# Altium schematic sheet RP2040_minimal.SchDoc
size 419 x 297 mm
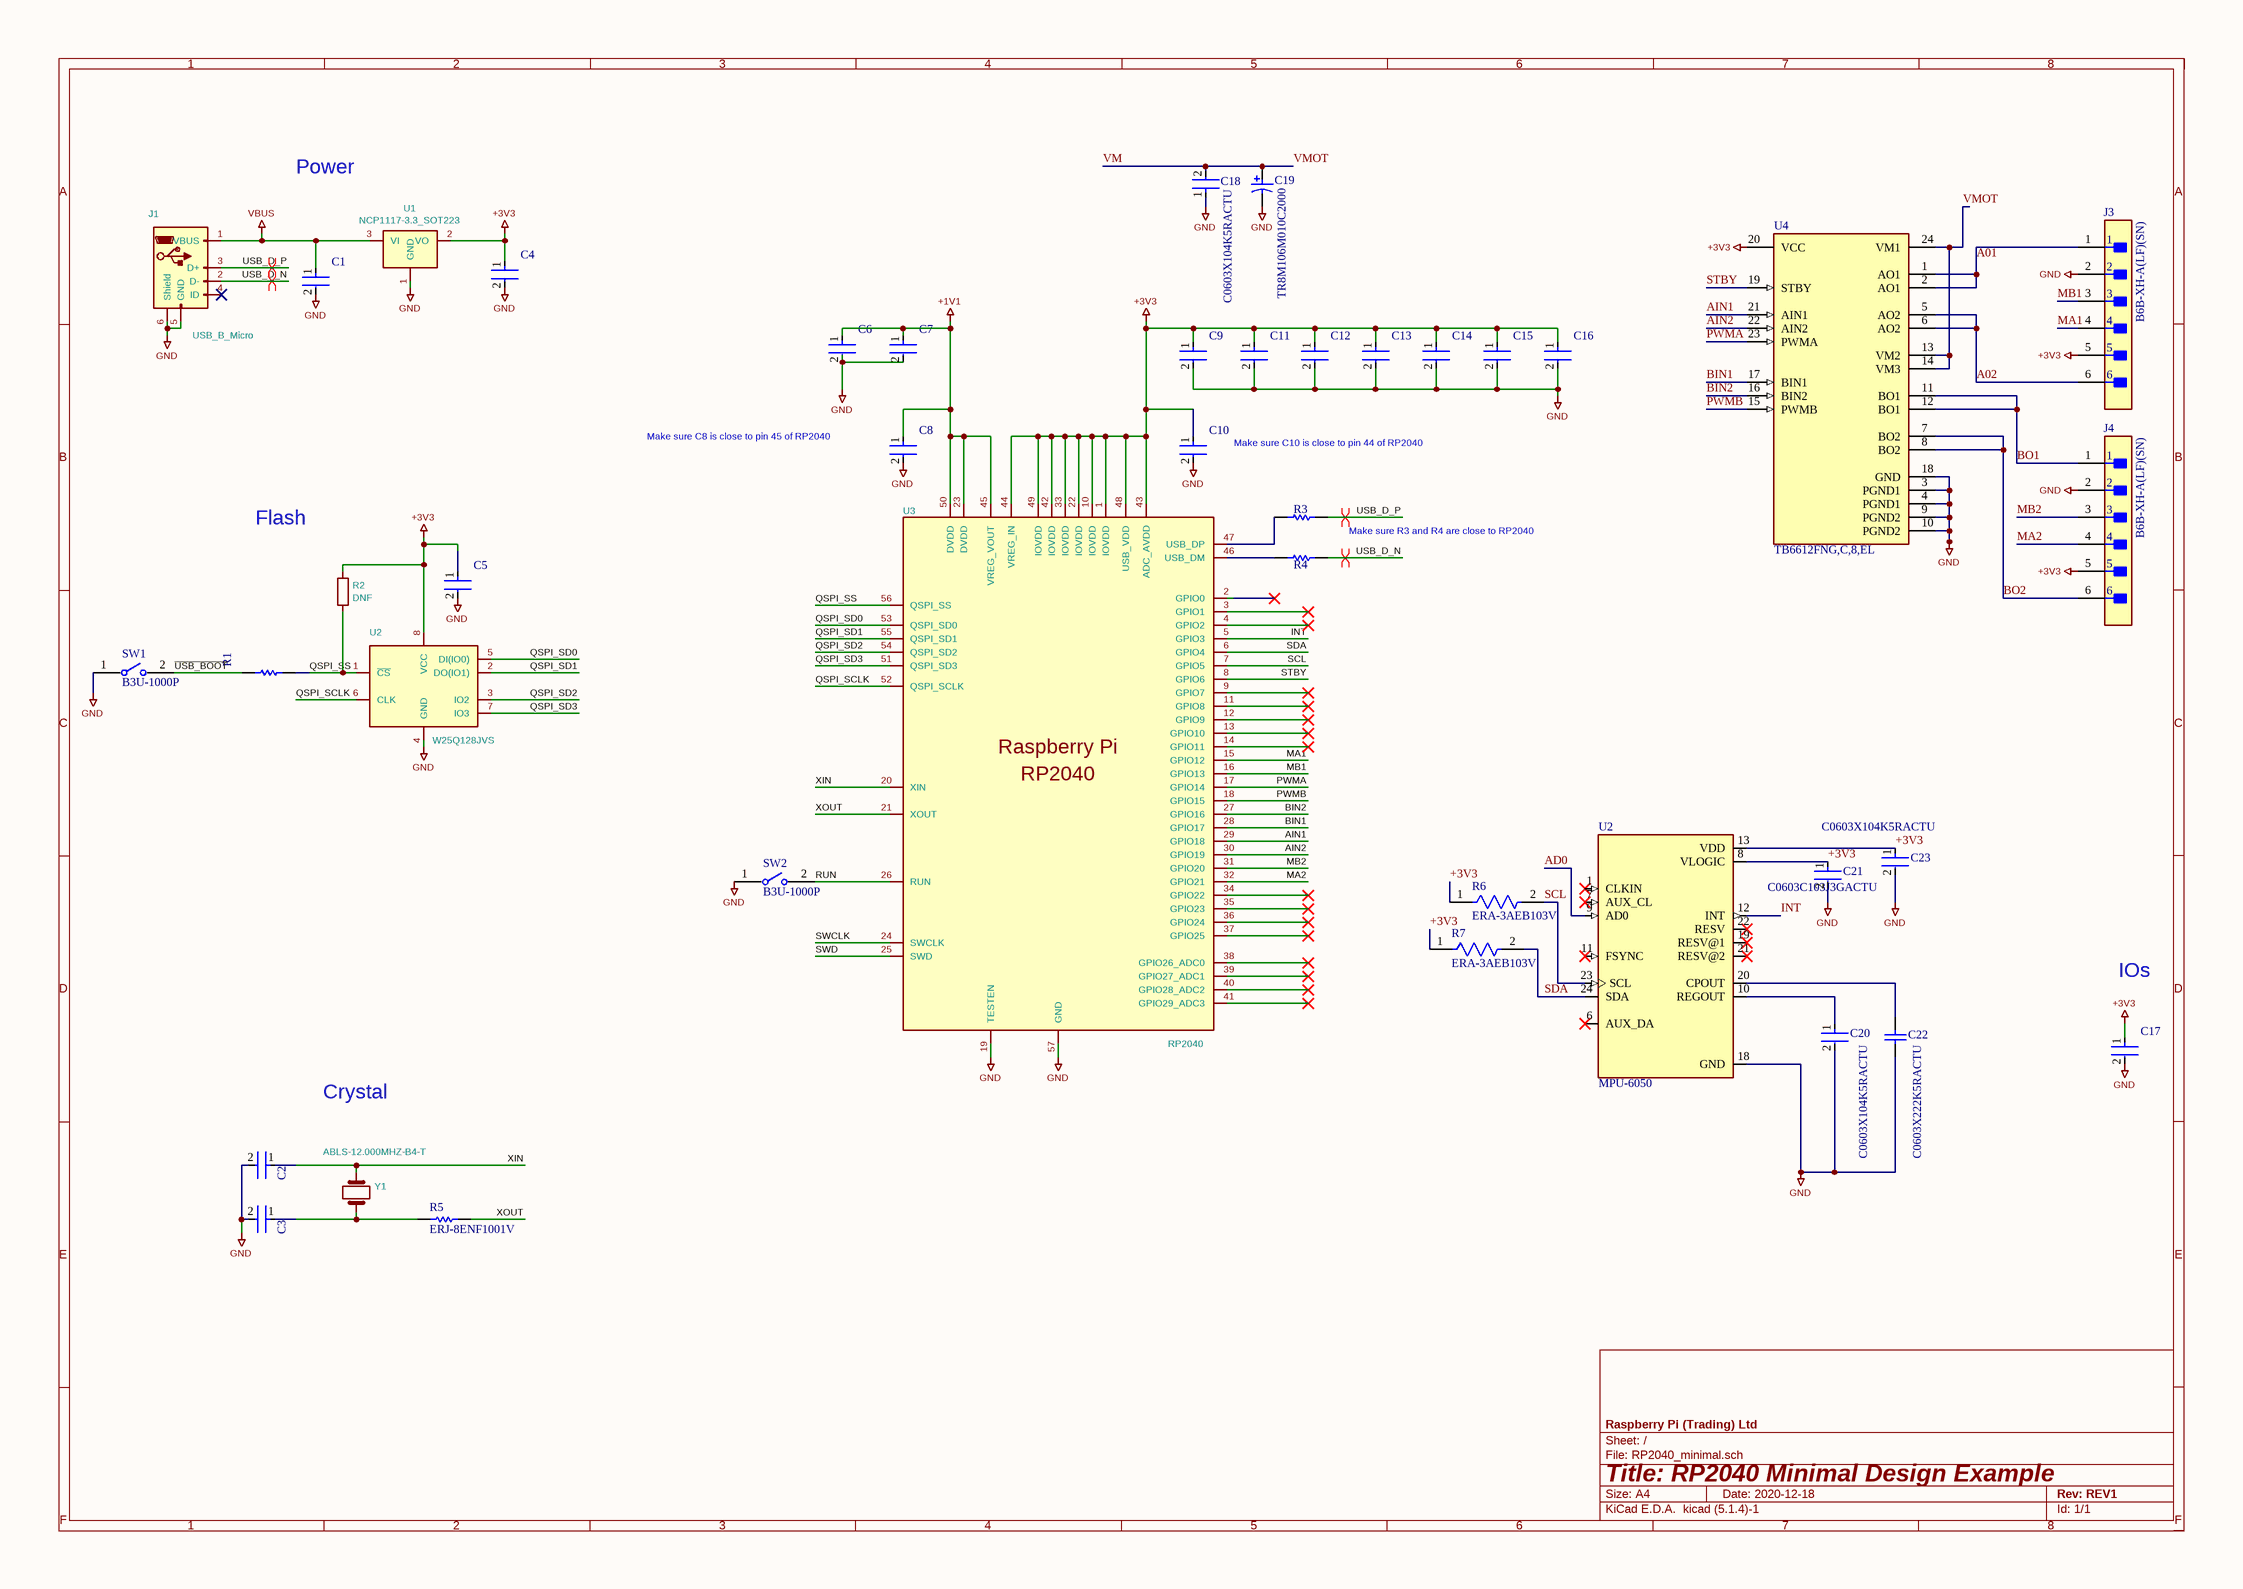
[diagram p0: RP2040_minimal.SchDoc]

## Parts
(Parts that share a designator on the sheet are numbered #1, #2 ... from top to bottom, then left to right.)
C1  GRM21BR61C106KE15K  [FP-GRM21B-0_1-MFG]  (value not drawn)
C2  GCM1555C1H270JA16D  [FP-GCM155-0_05-IPC_B]  (value not drawn)
C3  GCM1555C1H270JA16D  [FP-GCM155-0_05-IPC_B]  (value not drawn)
C4  GRM21BR61C106KE15K  [FP-GRM21B-0_1-MFG]  (value not drawn)
C5  GRM155R71E104KE14J  [FP-GRM155-0_05-IPC_C]  (value not drawn)
C6  GRM155R71E104KE14J  [FP-GRM155-0_05-IPC_C]  (value not drawn)
C7  GRM155R71E104KE14J  [FP-GRM155-0_05-IPC_C]  (value not drawn)
C8  GCM1555C1H270JA16D  [FP-GCM155-0_05-IPC_B]  (value not drawn)
C9  GRM155R71E104KE14J  [FP-GRM155-0_05-IPC_C]  (value not drawn)
C10  GCM1555C1H270JA16D  [FP-GCM155-0_05-IPC_B]  (value not drawn)
C11  GRM155R71E104KE14J  [FP-GRM155-0_05-IPC_C]  (value not drawn)
C12  GRM155R71E104KE14J  [FP-GRM155-0_05-IPC_C]  (value not drawn)
C13  GRM155R71E104KE14J  [FP-GRM155-0_05-IPC_C]  (value not drawn)
C14  GRM155R71E104KE14J  [FP-GRM155-0_05-IPC_C]  (value not drawn)
C15  GRM155R71E104KE14J  [FP-GRM155-0_05-IPC_C]  (value not drawn)
C16  GRM155R71E104KE14J  [FP-GRM155-0_05-IPC_C]  (value not drawn)
C17  GRM21BR61C106KE15K  [FP-GRM21B-0_1-MFG]  (value not drawn)
C18  C0603X104K5RACTU  [FP-C0603-CJ-MFG]
C19  TR8M106M010C2000  [VISH-TR8-M_L]
C20  C0603X104K5RACTU  [FP-C0603-CJ-MFG]
C21  C0603C103J3GACTU  [FP-C0603C-CF-MFG]
C22  C0603X222K5RACTU  [CAPC1608X87X35NL15T15]
C23  C0603X104K5RACTU  [FP-C0603-CJ-MFG]
J1  USB_B_Micro  [USB_Micro-B_Amphenol_10103594-0001LF_Horizontal_modified]
J3  B6B-XH-A(LF)(SN)  [FP-B6B-XH-A_LF_SN-MFG]
J4  B6B-XH-A(LF)(SN)  [FP-B6B-XH-A_LF_SN-MFG]
R1  RC0402FR-0727R4L  [RESC1005X40X25ML05T10]  (value not drawn)
R2  DNF  [0402-A]
R3  RC0402FR-0727R4L  [RESC1005X40X25ML05T10]  (value not drawn)
R4  RC0402FR-0727R4L  [RESC1005X40X25ML05T10]  (value not drawn)
R5  ERJ-8ENF1001V  [0402]
R6  ERA-3AEB103V  [FP-ERA3A-IPC_C]
R7  ERA-3AEB103V  [FP-ERA3A-IPC_C]
SW1  B3U-1000P  [FP-B3U-1000P-MFG]
SW2  B3U-1000P  [FP-B3U-1000P-MFG]
U1  NCP1117-3.3_SOT223  [SOT223_M]
U2#1  W25Q128JVS  [SOIC127P790X216-8N]
U2#2  MPU-6050  [QFN50P400X400X95-24N]
U3  RP2040  [Pico2040-QFN-56]
U4  TB6612FNG,C,8,EL  [FP-SSOP24-P-300-0_65A-IPC_A]
Y1  ABLS-12.000MHZ-B4-T  [Crystal_SMD_HC49-US]

## Nets
+1V1: C6.1 C7.1 C8.1 U3.23(DVDD) U3.45(VREG_VOUT) U3.50(DVDD)
+3V3: C4.1 C5.1 C9.1 C10.1 C11.1 C12.1 C13.1 C14.1 C15.1 C16.1 C17.1 C21.1 C23.1 J3.5 J4.5 R2.1 R6.1 R7.1 U1.2(VO) U2#1.8(VCC) U2#2.8(VLOGIC) U2#2.13(VDD) U3.1(IOVDD) U3.10(IOVDD) U3.22(IOVDD) U3.33(IOVDD) U3.42(IOVDD) U3.43(ADC_AVDD) U3.44(VREG_IN) U3.48(USB_VDD) U3.49(IOVDD) U4.20(VCC)
GND: C1.2 C2.2 C3.2 C4.2 C5.2 C6.2 C7.2 C8.2 C9.2 C10.2 C11.2 C12.2 C13.2 C14.2 C15.2 C16.2 C17.2 C18.1 C19.2 C20.2 C21.2 C22.2 C23.2 J1.5(GND) J1.6(Shield) J3.2 J4.2 SW1.1 SW2.1 U1.1(GND) U2#1.4(GND) U2#2.18(GND) U3.19(TESTEN) U3.57(GND) U4.3(PGND1) U4.4(PGND1) U4.9(PGND2) U4.10(PGND2) U4.18(GND)
VBUS: C1.1 J1.1(VBUS) U1.3(VI)
A01: J3.1 U4.1(AO1) U4.2(AO1)
A02: J3.6 U4.5(AO2) U4.6(AO2)
AD0: U2#2.9(AD0)
AIN1: U3.29(GPIO18) U4.21(AIN1)
AIN2: U3.30(GPIO19) U4.22(AIN2)
BIN1: U3.28(GPIO17) U4.17(BIN1)
BIN2: U3.27(GPIO16) U4.16(BIN2)
BO1: J4.1 U4.11(BO1) U4.12(BO1)
BO2: J4.6 U4.7(BO2) U4.8(BO2)
INT: U2#2.12(INT) U3.5(GPIO3)
MA1: J3.4 U3.15(GPIO12)
MA2: J4.4 U3.32(GPIO21)
MB1: J3.3 U3.16(GPIO13)
MB2: J4.3 U3.31(GPIO20)
PWMA: U3.17(GPIO14) U4.23(PWMA)
PWMB: U3.18(GPIO15) U4.15(PWMB)
QSPI_SCLK: U2#1.6(CLK) U3.52(QSPI_SCLK)
QSPI_SD0: U2#1.5(DI(IO0)) U3.53(QSPI_SD0)
QSPI_SD1: U2#1.2(DO(IO1)) U3.55(QSPI_SD1)
QSPI_SD2: U2#1.3(IO2) U3.54(QSPI_SD2)
QSPI_SD3: U2#1.7(IO3) U3.51(QSPI_SD3)
QSPI_SS: R1.2 R2.2 U2#1.1(~{CS}) U3.56(QSPI_SS)
RUN: SW2.2 U3.26(RUN)
SCL: R6.2 U2#2.23(SCL) U3.7(GPIO5)
SDA: R7.2 U2#2.24(SDA) U3.6(GPIO4)
STBY: U3.8(GPIO6) U4.19(STBY)
SWCLK: U3.24(SWCLK)
SWD: U3.25(SWD)
~{USB_BOOT}: R1.1 SW1.2
USB_D_N: J1.2(D-) R4.2
USB_D_P: J1.3(D+) R3.2
VM: C18.2 C19.1 U4.13(VM2) U4.14(VM3) U4.24(VM1)  [also labelled VMOT]
XIN: C2.1 U3.20(XIN) Y1.1
XOUT: R5.2 U3.21(XOUT)
NetC3_1: C3.1 R5.1 Y1.2
NetC20_1: C20.1 U2#2.10(REGOUT)
NetC22_1: C22.1 U2#2.20(CPOUT)
NetR3_1: R3.1 U3.47(USB_DP)
NetR4_1: R4.1 U3.46(USB_DM)

Not connected (* = marked no-connect by the designer): J1 4(ID)*; U2#2 1(CLKIN)* 6(AUX_DA)* 7(AUX_CL)* 11(FSYNC)* 19(RESV@1)* 21(RESV@2)* 22(RESV)*; U3 2(GPIO0)* 3(GPIO1)* 4(GPIO2)* 9(GPIO7)* 11(GPIO8)* 12(GPIO9)* 13(GPIO10)* 14(GPIO11)* 34(GPIO22)* 35(GPIO23)* 36(GPIO24)* 37(GPIO25)* 38(GPIO26_ADC0)* 39(GPIO27_ADC1)* 40(GPIO28_ADC2)* 41(GPIO29_ADC3)*

## Layout directives
differential pair: USB_D_N, USB_D_P

## Notes on the sheet
- Power
- Make sure C8 is close to pin 45 of RP2040
- (near C10) Make sure C10 is close to pin 44 of RP2040
- Flash
- Make sure R3 and R4 are close to RP2040
- IOs
- Crystal
- 1
- 2
- 3
- 4
- 5
- 6
- 7
- 8
- A
- B
- C
- D
- E
- Title: RP2040 Minimal Design Example
- File: RP2040_minimal.sch
- Sheet: /
- Raspberry Pi (Trading) Ltd
- F
- KiCad E.D.A.  kicad (5.1.4)-1
- Size: A4
- Date: 2020-12-18
- Rev: REV1
- Id: 1/1
- (in symbol RP2040) Raspberry Pi

## Library data of the parts
C1 C4 C17 = CMP-2007-03534-2: Chip Multilayer Ceramic Capacitors for General Purpose, 0805, 10uF, X5R, 15%, 10%, 16V; Case Code (Imperial): 0805; Packaging: Tape and Reel; Width: 0.049inch; Depth: 1.25mm; Voltage Rating: 16V; Height: 1.25mm; Case/Package: 0805; Max Operating Temperature: 85°C; Min Operating Temperature: -55°C; Tolerance: 10%; Dielectric: X5R; REACH SVHC: No SVHC; Mount: Surface Mount; Radiation Hardening: No; Case Code (Metric): 2012; Length: 2mm; Package Quantity: 10000; Voltage Rating (DC): 16V; Voltage: 16V; Capacitance: 10uF; Thickness: 0.053inch; Termination: SMD/SMT
C2 C3 C8 C10 = CMP-06035-017587-1: Ceramic Capacitor for Automotive 27pF ±5% 50VDC C0G 0402 Paper T/R; Voltage Rating: 50V; Case Code (Metric): 1005; Height: 0.5mm; Min Operating Temperature: -55°C; Case/Package: 0402; Mount: Surface Mount; Width: 0.02inch; Capacitance: 27pF; Termination: SMD/SMT; Thickness: 0.022inch; Length: 0.039inch; Case Code (Imperial): 0402; Packaging: Tape and Reel; Ratings: AEC-Q200; Dielectric: C0G; Weight: 0.000212oz; Max Operating Temperature: 125°C; Package Quantity: 10000; Tolerance: 5%; Voltage Rating (DC): 50V
C5-C7 C9 C11-C16 = CMP-06035-003995-1: Chip Multilayer Ceramic Capacitors for General Purpose, 0402, 0.10uF, X7R, 15%, 10%, 25V; Capacitance: 100nF; Resistor Type: Ceramic; Tolerance: 10%; Case Code (Metric): 1005; Termination: SMD/SMT; Mount: Surface Mount; Voltage Rating: 25V; Voltage Rating (DC): 25V; Case Code (Imperial): 0402; Max Operating Temperature: 125°C; Weight: 0.000212oz; Case/Package: 0402; Length: 0.039inch; Width: 0.5mm; Thickness: 0.022inch; Height: 0.5mm; Packaging: Tape and Reel; Package Quantity: 50000; Min Operating Temperature: -55°C; Dielectric: X7R
C18 C20 C23 = CMP-2006-03300-2: CAP CER 0.1UF 50V X7R 0603; Manufacturer: Kemet; Capacitance: 100nF; Material: Ceramic; Tolerance: 10%; Value: 100nF; Temperature Coefficient: 15%; Temperature Range High: +125°C; Temperature Range Low: -55°C; Manufacturer Part Number: C0603X104K5RACTU; Voltage: 50V; ComponentLink2Description: Datasheet; RoHS: TRUE; ComponentLink2URL: https://content.kemet.com/datasheets/KEM_C1013_X7R_FT-CAP_SMD.pdf; Device Class L3: Ceramic Capacitors; Device Class L2: Capacitors; Package: C0603-CJ; Height: 0.95mm; Device Class L1: Passive Components; Temperature Characteristic: X7R; Lead Free: Yes; Digikey Description: CAP CER 0.1UF 50V X7R 0603; Automotive: No; Mouser Description: Capacitor; Ceramic; Cap 0.1uF; Tol+10%; SMT; Flexible Termination; Vol-Rtg 50V; TR; Temperature: -55°C to +125°C; Octopart: https://octopart.com/c0603x104k5ractu-kemet-9145062; Category: Cap; Voltage Rating: 50V; Ipc Land Pattern Name: CAPC16080X80
C19 = CMP-2000-07316-1: Tantalum Capacitor, 10 uF, +/- 20%, 10 V, -55 to 125 degC, 2-Pin SMD (M), RoHS, Tape and Reel; Manufacturer: Vishay; Capacitance: 10µF; Featured Product: TR8SeriesMoldedMicroTan™TantalumChipCapacitors; ESR (Equivalent Series Resistance): 2Ohm; Other Names: 718-1673-6; Catalog Drawings: TR8SeriesTR8SeriesBottom; Online Catalog: MICROTAN®TR8Series; Voltage - Rated: 10V; Type: Molded; Mounting Technology: SurfaceMount; Category: Capacitors; Lifetime @ Temp.: -; Package Reference: TR8-M; Size / Dimension: 0.063"Lx0.033"W(1.60mmx0.85mm); Operating Temperature: -55°C~125°C; Mounting Type: SurfaceMount; Lead Spacing: -; Tolerance: ±20%; Standard Package: 1; Datasheet URL: http://www.vishay.com/docs/40114/tr8.pdf; Package Description: 2-Pin Surface Mount Device, Body 1.6 x 0.85 mm; Height - Seated (Max): 0.035"(0.89mm); Family: TantalumCapacitors; Manufacturer Size Code: M; Series: MICROTAN®TR8; Packaging: Digi-Reel®; Manufacturer URL: http://www.vishay.com/; Datasheet Version: 03/2016; Package / Case: 0603(1608Metric); Features: GeneralPurpose
C21 = CMP-2006-03705-3: CAP CER 10000PF 25V 5% NP0 0603; Manufacturer: KEMET; Material: Ceramic; Temperature Coefficient: 30ppm/°C; Automotive Grade: Grade 1; Capacitance: 10,000 pF; Temperature Characteristic: C0G; Value: 10,000 pF; Tolerance: 0.05; Temperature: -55°C to +125°C; ComponentLink2URL: https://api.kemet.com/component-edge/download/datasheet/C0603C100J5GACAUTO.pdf; ComponentLink2Description: Datasheet; Digikey Description: CAP CER 10000PF 25V 5% NP0 0603; Octopart: https://octopart.com/c0603c103j3gactu-kemet-10686801; Package: C0603C-CF; Automotive: Yes; Category: Cap; Manufacturer Part Number: C0603C103J3GACTU; Voltage Rating: 25 V; RoHS: TRUE; Device Class L1: Passive Components; Temperature Range Low: -55°C; Lead Free: Yes; Height: 0.87mm; Temperature Range High: +125°C; Device Class L3: Ceramic Capacitors; Mouser Description: 0603 C 10nF Ceramic Multilayer Capacitor, 25 V, +125degC, C0G Dielectric, +/-5%; Device Class L2: Capacitors
C22 = CMP-2006-03302-1: Manufacturer: Kemet; Part Number: C0603X222K5RACTU
J3 J4 = CMP-17439-000076-1: CONN HEADER VERT 6POS 2.5MM
R1 R3 R4 = CMP-2002-07553-1: Manufacturer: Yageo / Phycomp; Part Number: RC0402FR-0727R4L
R2 = R: Value: DNF; Footprint: Capacitor_SMD:C_0402_1005Metric
R5 = RES: Manufacturer: Panasonic; Part Number: ERJ-8ENF1001V
R6 R7 = CMP-2000-00874-2: RES SMD 10K OHM 0.1% 1/10W 0603; Voltage Rating (DC): 75V; Power Rating: 100mW; Resistance: 10kR; Temperature Coefficient: 25ppm/°C; Radiation Hardening: No; Width: 0.8mm; Depth: 0.8mm; Construction: Rectangular; Case Code (Metric): 1608; Package Quantity: 5000; Length: 1.6mm; Size Code: 0603; Case Code (Imperial): 0603; Termination: SMD/SMT; Contact Plating: Tin; Resistance Tolerance: 0.1%; Military Standard: Not; Packaging: Tape and Reel; Max Power Dissipation: 100mW; REACH SVHC: No SVHC; Series: ERA-3A; Voltage Rating: 75V; Lead Free: Lead Free; Technology: METAL FILM; RoHS Compliant: Yes; Max Operating Temperature: 155°C; Resistor Type: Thin Film; Min Operating Temperature: -55°C; Number of Pins: 2; Case/Package: 0603; Tolerance: 0.1%; Height: 0.45mm; Mount: Surface Mount; Number of Terminations: 2
SW1 SW2 = CMP-2100-03586-2: SWITCH TACTILE SPST-NO 0.05A 12V; Contact Resistance: 100mR; Operating Force: 1.5N; Max Current Rating: 50mA; Switch Travel: 0.15mm; Actuator Type: Standard; Mechanical Life: 200000Cycles; Ratings: Dust Proof; Illumination Type: Non-Illuminated; Throw Configuration: SPST; Actuator Length: 0.4mm; Switch Function: Off-Mom; Height: 1.2mm; Width: 3mm; Weight: 0.000776oz; Contact Material: Silver; Max Voltage Rating (DC): 12V; Insulation Resistance: 100MR; Lead Free: Lead Free; Current Rating: 50mA; Termination: SMD/SMT; Length: 4mm; Voltage Rating (DC): 12V; Contact Current Rating: 50mA; Orientation: Straight; Depth: 2.5mm; Max Operating Temperature: 70°C; Packaging: Tape and Reel; Min Operating Temperature: -25°C; Package Quantity: 1; Mount: Surface Mount; Electrical Life: 200000Cycles
U2#2 = MPU-6050: MPU-6050 series Accelerometer, Gyroscope, 3 Axis Sensor Evaluation Board; MF: TDK InvenSense; Value: *; SnapEDA_Link: https://www.snapeda.com/parts/MPU-6050/TDK+InvenSense/view-part/?ref=snap; Purchase-URL: https://pricing.snapeda.com/search/part/MPU-6050/?ref=eda; Availability: In Stock; Price: None; Package: QFN-24 InvenSense; Check_prices: https://www.snapeda.com/parts/MPU-6050/TDK+InvenSense/view-part/?ref=eda; MP: MPU-6050
U4 = CMP-2100-03693-4: IC MOTOR DRIVER 2.7V-5.5V 24SSOP; Logic Function: AND GATE; Interface: Parallel; Operating Supply Voltage: 3V; Max Supply Voltage: 5.5V; Output Current: 1A; Min Supply Voltage: 2.7V; Number of Outputs: 2; Packaging: Tape and Reel; Mount: Surface Mount; Number of Pins: 24; Min Operating Temperature: -20°C; Case/Package: SSOP; Series: -; Max Operating Temperature: 85°C; Package Quantity: 1
Y1 = Crystal: Value: ABLS-12.000MHZ-B4-T; Footprint: RP2040_minimal:Crystal_SMD_HC49-US
J1 = USB_B_Micro: Value: USB_B_Micro; Footprint: RP2040_minimal:USB_Micro-B_Amphenol_10103594-0001LF_Horizontal_modified
U1 = NCP1117-3.3_SOT223: Value: NCP1117-3.3_SOT223; Footprint: Package_TO_SOT_SMD:SOT-223-3_TabPin2
U2#1 = W25Q128JVS: Value: W25Q128JVS; Footprint: Package_SO:SOIC-8_5.23x5.23mm_P1.27mm
U3 = RP2040: Value: RP2040; Footprint: RP2040_minimal:RP2040-QFN-56